# EAGLE design P8X32A_Breakout (EAGLE 6.3)
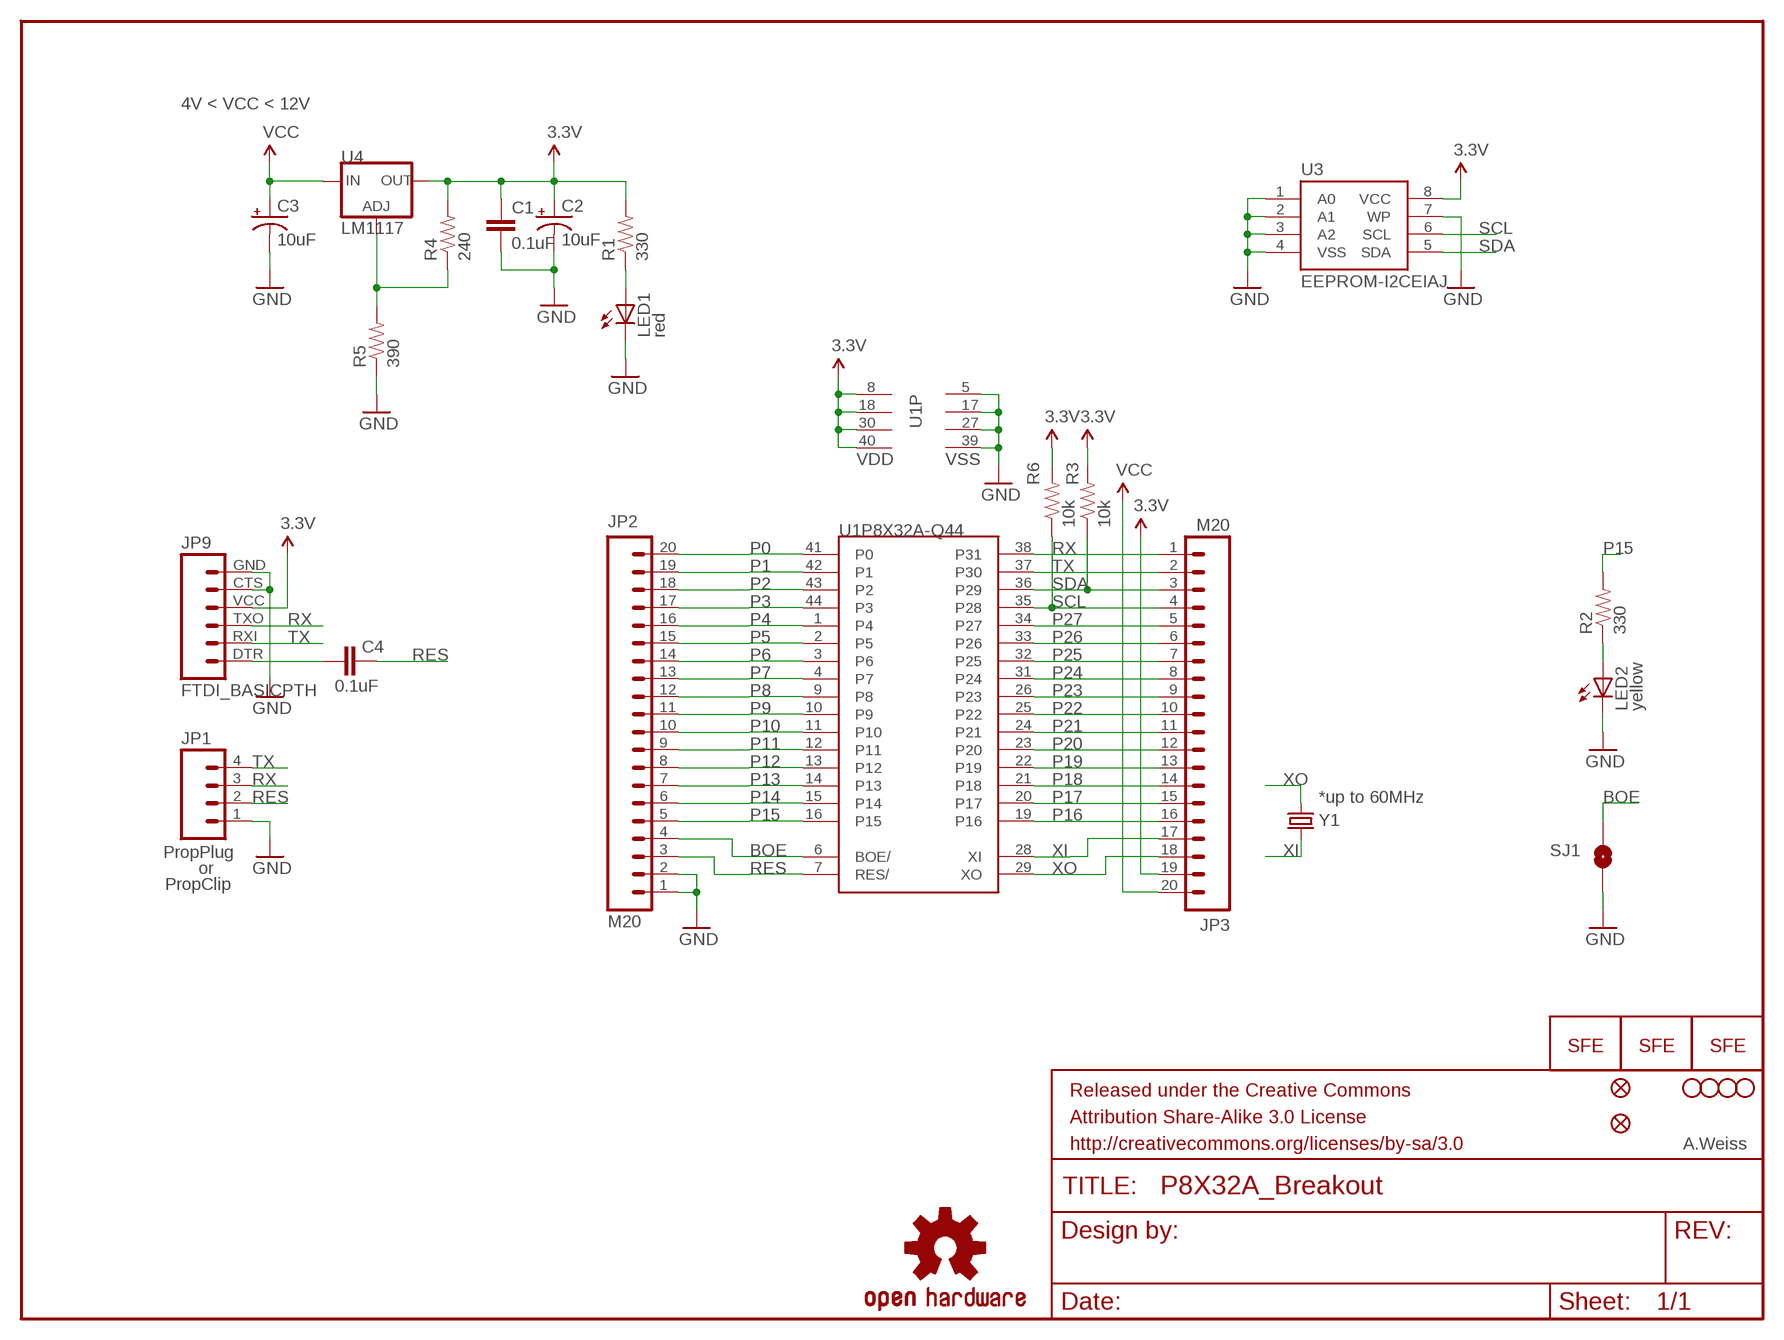
[diagram p0: schematic, sheet 1]

## Parts
C1  0.1uF  CAP0402-CAP  [0402-CAP]
C2  10uF  CAP_POL1206  [EIA3216]
C3  10uF  CAP_POL1206  [EIA3216]
C4  0.1uF  CAP0402-CAP  [0402-CAP]
FRAME1  FRAME-LETTER  [CREATIVE_COMMONS]
JP1  PropPlug  M04PTH  [1X04]
JP2  M20  [1X20]
JP3  M20  [1X20]
JP4  FIDUCIALUFIDUCIAL  [MICRO-FIDUCIAL]
JP5  LOGO-SFENEW  [SFE-NEW-WEBLOGO]
JP7  LOGO-SFESK  [SFE-LOGO-FLAME]
JP9  FTDI_BASICPTH  [FTDI_BASIC]
JP10  STAND-OFF  [STAND-OFF]
JP11  STAND-OFF  [STAND-OFF]
JP12  STAND-OFF  [STAND-OFF]
JP13  STAND-OFF  [STAND-OFF]
JP14  LOGO-SFENW2  [SFE-NEW-WEB]
JP15  FIDUCIALUFIDUCIAL  [MICRO-FIDUCIAL]
LED1  red  LED0603  [LED-0603]
LED2  yellow  LED0603  [LED-0603]
R1  330  RESISTOR0402-RES  [0402-RES]
R2  330  RESISTOR0402-RES  [0402-RES]
R3  10k  RESISTOR0402-RES  [0402-RES]
R4  240  RESISTOR0402-RES  [0402-RES]
R5  390  RESISTOR0402-RES  [0402-RES]
R6  10k  RESISTOR0402-RES  [0402-RES]
SJ1  SOLDERJUMPERTRACE  [SJ_2S-TRACE]
U1  P8X32A-Q44  [P8X32A-Q44]
U3  EEPROM-I2CEIAJ  [SO08-EIAJ]
U4  V_REG_317SMD  [SOT223]
U$1  OSHW-LOGOS  [OSHW-LOGO-S]
Y1  CRYSTALHC49UV  [HC49U-V]

## Nets
3.3V: C1.1 C2.A(+) JP3.19 JP9.VCC R1.2 R3.2 R4.2 R6.2 U1.8(P:VDD) U1.18(P:VDD) U1.30(P:VDD) U1.40(P:VDD) U3.8(VCC) U4.2(OUT)
BOE: JP2.4 SJ1.2 U1.6(P8X32A-Q44:BOE/)
GND: C1.2 C2.C(-) C3.C(-) JP1.1 JP2.1 JP2.2 JP9.CTS JP9.GND LED1.C LED2.C R5.1 SJ1.1 U1.5(P:VSS) U1.17(P:VSS) U1.27(P:VSS) U1.39(P:VSS) U3.1(A0) U3.2(A1) U3.3(A2) U3.4(VSS) U3.7(WP)
N$1: LED1.A R1.1
N$2: LED2.A R2.1
N$3: R4.1 R5.2 U4.1(ADJ)
N$5: C4.1 JP9.DTR
P0: JP2.20 U1.41(P8X32A-Q44:P0)
P1: JP2.19 U1.42(P8X32A-Q44:P1)
P2: JP2.18 U1.43(P8X32A-Q44:P2)
P3: JP2.17 U1.44(P8X32A-Q44:P3)
P4: JP2.16 U1.1(P8X32A-Q44:P4)
P5: JP2.15 U1.2(P8X32A-Q44:P5)
P6: JP2.14 U1.3(P8X32A-Q44:P6)
P7: JP2.13 U1.4(P8X32A-Q44:P7)
P8: JP2.12 U1.9(P8X32A-Q44:P8)
P9: JP2.11 U1.10(P8X32A-Q44:P9)
P10: JP2.10 U1.11(P8X32A-Q44:P10)
P11: JP2.9 U1.12(P8X32A-Q44:P11)
P12: JP2.8 U1.13(P8X32A-Q44:P12)
P13: JP2.7 U1.14(P8X32A-Q44:P13)
P14: JP2.6 U1.15(P8X32A-Q44:P14)
P15: JP2.5 R2.2 U1.16(P8X32A-Q44:P15)
P16: JP3.16 U1.19(P8X32A-Q44:P16)
P17: JP3.15 U1.20(P8X32A-Q44:P17)
P18: JP3.14 U1.21(P8X32A-Q44:P18)
P19: JP3.13 U1.22(P8X32A-Q44:P19)
P20: JP3.12 U1.23(P8X32A-Q44:P20)
P21: JP3.11 U1.24(P8X32A-Q44:P21)
P22: JP3.10 U1.25(P8X32A-Q44:P22)
P23: JP3.9 U1.26(P8X32A-Q44:P23)
P24: JP3.8 U1.31(P8X32A-Q44:P24)
P25: JP3.7 U1.32(P8X32A-Q44:P25)
P26: JP3.6 U1.33(P8X32A-Q44:P26)
P27: JP3.5 U1.34(P8X32A-Q44:P27)
RES: C4.2 JP1.2 JP2.3 U1.7(P8X32A-Q44:RES/)
RX: JP1.3 JP3.1 JP9.TXO U1.38(P8X32A-Q44:P31)
SCL: JP3.4 R6.1 U1.35(P8X32A-Q44:P28) U3.6(SCL)
SDA: JP3.3 R3.1 U1.36(P8X32A-Q44:P29) U3.5(SDA)
TX: JP1.4 JP3.2 JP9.RXI U1.37(P8X32A-Q44:P30)
VCC: C3.A(+) JP3.20 U4.3(IN)
XI: JP3.17 U1.28(P8X32A-Q44:XI) Y1.2
XO: JP3.18 U1.29(P8X32A-Q44:XO) Y1.1

## Notes on the sheet
- 4V < VCC < 12V
- LM1117
- *up to 60MHz
- or
- PropClip
- A.Weiss

## Library data of the parts
C1 C4 = SparkFun-Passives:CAP: Capacitor Standard 0603 ceramic capacitor, and 0.1" leaded capacitor.
C2 C3 = SparkFun-Passives:CAP_POL: Capacitor Polarized These are standard SMD and PTH capacitors. Normally 10uF, 47uF, and 100uF in electrolytic and tantalum varieties. Always verify the external diameter of the through hole cap, it varies with capacity, voltage, and manufacturer. The EIA devices should be standard.
FRAME1 = SparkFun-Aesthetics:FRAME-LETTER: Schematic Frame Standard 8.5x11 US Letter frame
JP1 = SparkFun-Connectors:M04: Header 4 Standard 4-pin 0.1" header. Use with straight break away headers (SKU : PRT-00116), right angle break away headers (PRT-00553), swiss pins (PRT-00743), machine pins (PRT-00117), and female headers (PRT-00115). Molex polarized connector foot print use with SKU : PRT-08231 with associated crimp pins and housings. 1MM SMD Version SKU: PRT-10208
JP2 JP3 = SparkFun-Connectors:M20: 1x20 .1" header This is just like the LOCK variant in that the holes are staggared by 5 mil, but except for the last two holes. They are not altered from the "standard" footprint layout. This is used for a special purpose on the layout of our Graphic LCD Backpack. Make sure you want to use this device before selecting it for you project!
JP4 JP15 = SparkFun:FIDUCIAL: Fiducial Alignment Points Various fiducial points for machine vision alignment.
JP5 JP7 JP14 = SparkFun-Aesthetics:LOGO-SFE: Spark Fun Electronics PCB Logo This is the standard Spark Fun Electronics PCB logo.
JP9 = SparkFun-Connectors:FTDI_BASIC: FTDI Basic header with labels
JP10-JP13 = SparkFun-Electromechanical:STAND-OFF: #4 Stand Off This is the mechanical footprint for a #4 phillips button head screw. Use the keepout ring to avoid running the screw head into surrounding components. SKU : PRT-00447
LED1 LED2 = SparkFun-LED:LED: LEDs Standard schematic elements and footprints for 5mm, 3mm, 1206, and 0603 sized LEDs. 5mm - Spark Fun Electronics SKU : COM-00529 (and others)
R1-R6 = SparkFun-Passives:RESISTOR: Resistor Basic schematic elements and footprints for 0603, 1206, and PTH resistors.
SJ1 = SparkFun-Passives:SOLDERJUMPER: Solder Jumper Standard SMD solder jumper. Used to automate production. Two varients : Normally Open and Normally Closed are the same, but have different paste layers. NC will have a large amount of paste and should jumper during reflow.
U1 = SparkFun-DigitalIC:P8X32A-Q44: Propellor uC
U3 = SparkFun-DigitalIC:EEPROM-I2C: I2C EEPROM chips, 24LC256 (and others)
U4 = SparkFun-PowerIC:V_REG_317: Voltage Regulator Standard LM317 adjustable voltage regulator. AOI (Adjust Output Input). Google 'LM317 Calculator' for easy to use app to get the two resistor values needed. 240/720 for 5V output. 240/390 for 3.3V output. Spark Fun Electronics SKU : COM-00527
U$1 = SparkFun-Aesthetics:OSHW-LOGO: Open Source Hardware Logo This logo indicates the piece of hardware it is found on incorporates a OSHW license and/or adheres to the definition of open source hardware found here: http://freedomdefined.org/OSHW
Y1 = SparkFun-FreqCtrl:CRYSTAL: Various standard crystals. Proven footprints. Spark Fun Electronics SKU : COM-00534

## Board
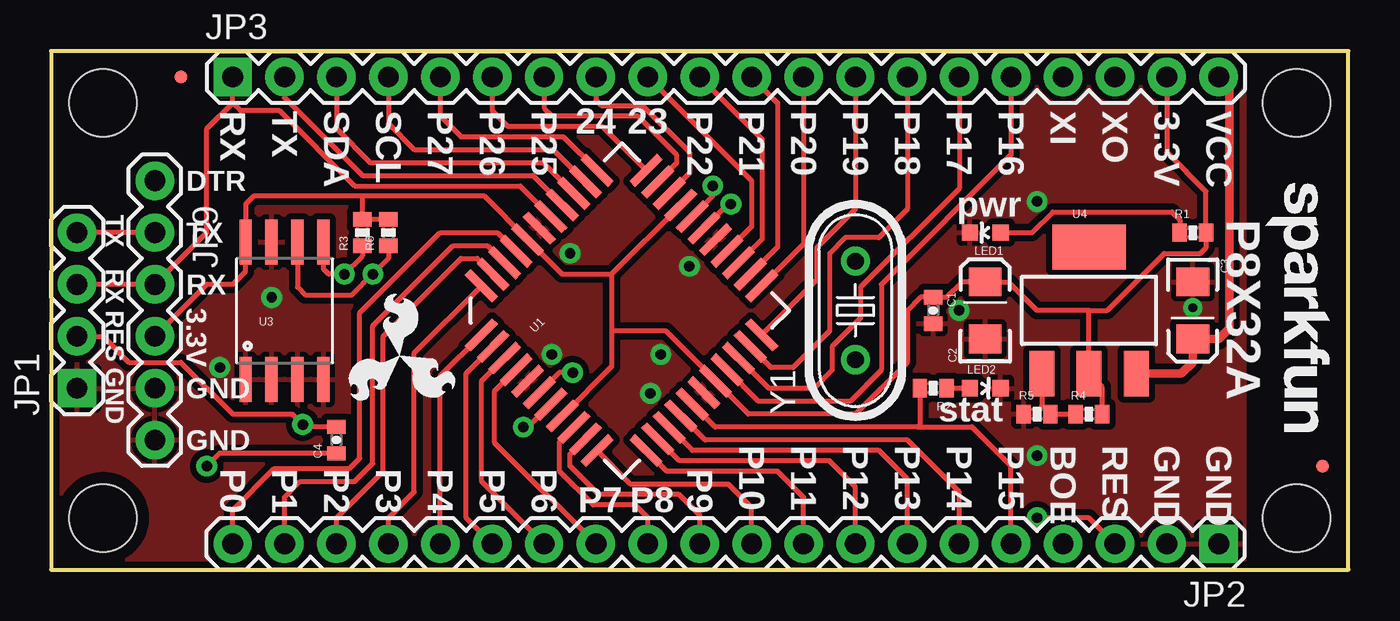
[diagram p1: board, top side]
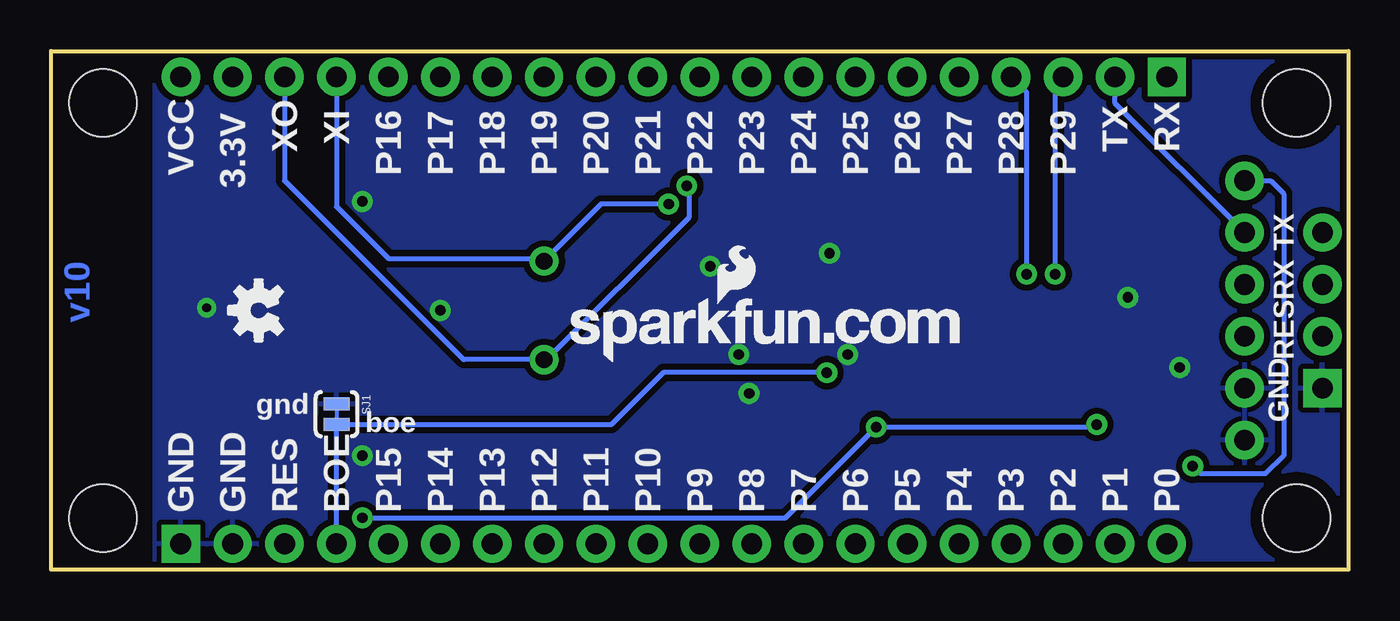
[diagram p2: board, bottom side, seen from below]

Size 63.5 x 25.4 mm. Coordinates in mm from the lower left corner, seen from the top.
Outline: 0,0 63.5,0 63.5,25.4 0,25.4 0,0
Copper layers (1*16): Top 0.035559375mm / dielectric 1.501140625mm / Bottom 0.035559375mm
Design rules "default": minimum track width 8mil, minimum drill 20mil, track to track 8mil, track to pad 8mil, pad to pad 8mil, via to via 8mil, smd to smd 8mil, copper to edge 8mil, drill to drill 8mil, minimum pad ring 12mil, minimum via ring 10mil, stop-mask expansion 4mil, vias tented up to drill 20mil, thermal gap 10mil

### Footprints (pad centres in the part's own frame; a part is rotated, then mirrored left to right if it is on the bottom)
0402-CAP = smd 0.7 x 0.9: 1 -0.65,0; 2 0.65,0
EIA3216 = smd 1.4 x 1.6: A 1.4,0; C -1.4,0
1X04 = drill 1.016 pad 1.88 square: 1 0,0 | drill 1.016 pad 1.88: 2 2.54,0; 3 5.08,0; 4 7.62,0
1X20 = drill 1.016 pad 1.88 square: 1 0,0 | drill 1.016 pad 1.88: 2 2.54,0; 3 5.08,0; 4 7.62,0; 5 10.16,0; 6 12.7,0; 7 15.24,0; 8 17.78,0; 9 20.32,0; 10 22.86,0; 11 25.4,0; 12 27.94,0; 13 30.48,0; 14 33.02,0; 15 35.56,0; 16 38.1,0; 17 40.64,0; 18 43.18,0; 19 45.72,0; 20 48.26,0
MICRO-FIDUCIAL = smd 0.635 x 0.635: 1 0,0
FTDI_BASIC = drill 1.016 pad 1.88: CTS 10.16,0; DTR 0,0; GND 12.7,0; RXI 2.54,0; TXO 5.08,0; VCC 7.62,0
STAND-OFF = hole 3.302: 0,0
LED-0603 = smd 0.8 x 0.8: A 0,-0.75; C 0,0.75
0402-RES = smd 0.7 x 0.9: 1 -0.65,0; 2 0.65,0
SJ_2S-TRACE = smd 0.635 x 1.27: 1 -0.508,0; 2 0.508,0
P8X32A-Q44 = smd 1.9 x 0.4: 1 -5.713,4.013; 2 -5.713,3.212; 3 -5.713,2.413; 4 -5.713,1.613; 5 -5.713,0.812; 6 -5.713,0.013; 7 -5.713,-0.787; 8 -5.713,-1.587; 9 -5.713,-2.388; 10 -5.713,-3.188; 11 -5.713,-3.987; 23 5.688,-3.987; 24 5.688,-3.188; 25 5.688,-2.388; 26 5.688,-1.587; 27 5.688,-0.787; 28 5.688,0.013; 29 5.688,0.812; 30 5.688,1.613; 31 5.688,2.413; 32 5.688,3.212; 33 5.688,4.013 | smd 0.4 x 1.9: 12 -4.013,-5.688; 13 -3.212,-5.688; 14 -2.413,-5.688; 15 -1.613,-5.688; 16 -0.812,-5.688; 17 -0.013,-5.688; 18 0.787,-5.688; 19 1.587,-5.688; 20 2.388,-5.688; 21 3.188,-5.688; 22 3.987,-5.688; 34 3.987,5.713; 35 3.188,5.713; 36 2.388,5.713; 37 1.587,5.713; 38 0.787,5.713; 39 -0.013,5.713; 40 -0.812,5.713; 41 -1.613,5.713; 42 -2.413,5.713; 43 -3.212,5.713; 44 -4.013,5.713
SO08-EIAJ = smd 0.61 x 2.21: 1 -1.905,-3.378; 2 -0.635,-3.378; 3 0.635,-3.378; 4 1.905,-3.378; 5 1.905,3.353; 6 0.635,3.353; 7 -0.635,3.353; 8 -1.905,3.353
SOT223 = smd 1.219 x 2.235: 1 -2.311,-3.099; 2 0,-3.099; 3 2.311,-3.099 | smd 3.6 x 2.2: 4 0,3.099
HC49U-V = drill 0.813: 1 -2.413,0; 2 2.413,0

### Placement (x,y rotation side)
C1  43.18,12.7 270 top
C2  45.72,12.7 90 top
C3  55.88,12.7 270 top
C4  13.97,6.35 90 top
FRAME1  3.56,-2.54 0 top
JP1  1.27,8.89 90 top
JP2  57.15,1.27 180 top
JP3  8.89,24.13 0 top
JP4  6.35,24.13 0 top
JP5  38.1,10.16 0 bottom
JP6  LOGO-SFESK  [SFE-LOGO-FLAME]  17.07,10.47 155 top
JP7  17.07,10.47 30 top
JP8  LOGO-SFESK  [SFE-LOGO-FLAME]  17.07,10.47 265 top
JP9  5.08,19.05 270 top
JP10  60.96,22.86 0 top
JP11  60.96,2.54 0 top
JP12  2.54,2.54 0 top
JP13  2.54,22.86 0 top
JP14  59.44,18.92 270 top
JP15  62.23,5.08 0 top
LED1  45.72,16.51 90 top
LED2  45.72,8.89 270 top
R1  55.88,16.51 0 top
R2  43.18,8.89 180 top
R3  15.24,16.51 90 top
R4  50.8,7.62 0 top
R5  48.26,7.62 0 top
R6  16.51,16.51 90 top
SJ1  49.53,7.62 270 bottom
U1  27.94,12.7 45 top
U3  11.43,12.7 0 top
U4  50.8,12.7 0 top
U$1  53.34,12.7 90 bottom
Y1  39.37,12.7 90 top

### Tracks (layer width: path | path; a pad name or v marks a point on that pad's centre or on a via)
3.3V
  Top 0.254: 27.44,14.48 25.02,14.48 U1.40 21.21,18.29 15.24,18.29 | 27.44,14.48 U1.30 | 27.44,14.48 27.44,11.68 | 27.44,11.68 27.44,9.95 U1.8 | 27.44,11.68 30.1,11.68 32.52,9.26 U1.18 34.13,7.62 39.37,7.62 41.91,10.16 41.91,12.7 42.56,13.35 C1.1 43.83,13.35 44.58,14.1 C2.A 46.86,14.1 48.26,12.7 50.8,12.7 | R4.2 51.45,8.95 U4.2 50.8,12.7 | 50.8,12.7 51.69,12.7 54.48,15.49 56.26,15.49 56.53,15.76 R1.2 56.53,18.53 54.61,20.45 JP3.19 | JP9.VCC 7.62,13.97 8.89,13.97 9.51,14.59 9.51,16.07 U3.8 9.53,17.91 9.91,18.29 15.24,18.29 | R6.2 R3.2 15.24,18.29
BOE  (via drill 0.51)
  Top 0.254: v25.53,9.65 24.87,9.65 U1.6
  Bottom 0.254: JP2.4 SJ1.2 36.07,7.11 33.53,9.65 v25.53,9.65
GND  (via drill 0.43, 0.51)
  other vias: 48.26,18.03 44.45,12.7 24.51,10.54 25.4,15.49 31.24,14.86 29.84,10.54 29.34,8.64 8.26,9.91 10.79,13.34 48.26,5.59 55.88,12.83
  pour Bottom (isolate 0.305): 0,25.4 0,0 58.42,0 58.42,25.4
  pour Top (isolate 0.305): 0,25.4 0,0 58.42,0 58.42,25.4
N$1
  Top 0.254: LED1.A 48.01,16.51 49.02,17.53 54.86,17.53 55.24,17.14 55.24,16.52 R1.1
N$2
  Top 0.254: LED2.A R2.1
N$3
  Top 0.254: U4.1 48.49,8.04 R5.2 R4.1
N$5  (via drill 0.51)
  Top 0.254: C4.1 8.24,5.7 v7.62,5.08
  Bottom 0.254: JP9.DTR 3.81,19.05 3.17,18.41 3.17,5.59 4.06,4.7 7.24,4.7 v7.62,5.08
P0
  Top 0.254: JP2.20 8.89,2.92 10.92,4.95 14.61,4.95 15.11,5.46 15.11,12.57 19.05,16.51 21.85,16.51 U1.41
P1
  Top 0.254: JP2.19 11.43,3.56 12.19,4.32 14.86,4.32 15.75,5.21 15.75,11.94 19.68,15.88 21.35,15.88 U1.42
P2
  Top 0.254: JP2.18 13.97,2.54 16.26,4.83 16.26,11.43 20.07,15.24 20.86,15.24 U1.43
P3
  Top 0.254: JP2.17 16.51,2.54 17.78,3.81 17.78,10.62 U1.44
P4
  Top 0.254: JP2.16 19.05,9.48 U1.1
P5
  Top 0.254: JP2.15 20.32,2.54 20.32,9.62 U1.2
P6
  Top 0.254: JP2.14 21.08,4.32 21.08,9.25 U1.3
P7
  Top 0.254: JP2.13 21.72,6.22 21.72,8.76 U1.4
P8
  Top 0.254: JP2.12 29.21,2.54 28.57,3.17 26.54,3.17 24.89,4.83 24.89,6.28 U1.9
P9
  Top 0.254: JP2.11 31.75,2.67 30.73,3.68 26.8,3.68 25.4,5.08 25.4,5.65 U1.10
P10
  Top 0.254: JP2.10 34.29,3.05 33.15,4.19 28.37,4.19 U1.11
P11
  Top 0.254: JP2.9 36.83,3.56 35.56,4.83 30.14,4.83 U1.12
P12
  Top 0.254: JP2.8 39.37,4.06 38.1,5.33 30.76,5.33 U1.13
P13
  Top 0.254: JP2.7 41.91,4.45 40.51,5.84 31.39,5.84 U1.14
P14
  Top 0.254: JP2.6 44.45,3.81 41.91,6.35 32.01,6.35 U1.15
P15
  Top 0.254: JP2.5 46.99,5.08 45.07,7 45.05,6.99 42.42,6.99 | 42.42,6.99 32.51,6.99 U1.16 | R2.2 42.53,7.1 42.42,6.99
P16
  Top 0.254: JP3.16 46.99,20.32 40.64,13.97 40.64,9.78 39.12,8.26 34.63,8.26 U1.19
P17
  Top 0.254: JP3.15 44.45,18.67 39.62,13.84 39.62,12.32 38.23,10.92 38.23,9.78 37.34,8.89 35.13,8.89 U1.20
P18
  Top 0.254: JP3.14 41.91,17.65 40.51,16.26 38.86,16.26 38.1,15.49 38.1,11.68 36.32,9.91 35.24,9.91 U1.21
P19
  Top 0.254: JP3.13 39.37,17.65 37.47,15.75 37.47,14.18 U1.22
P20
  Top 0.254: JP3.12 36.83,15.95 U1.23
P21
  Top 0.254: JP3.11 35.56,22.86 35.56,15.81 U1.24
P22
  Top 0.254: JP3.10 34.8,21.08 34.8,16.18 U1.25
P23
  Top 0.254: JP3.9 34.29,19.05 34.29,16.8 U1.26
P24
  Top 0.254: JP3.8 26.67,22.99 26.92,22.73 28.96,22.73 31.24,20.45 31.24,19.41 U1.31
P25
  Top 0.254: JP3.7 24.13,22.61 24.51,22.23 28.7,22.23 30.61,20.32 30.61,19.91 U1.32
P26
  Top 0.254: JP3.6 21.59,22.48 22.35,21.72 26.97,21.72 U1.33
P27
  Top 0.254: JP3.5 19.05,22.23 20.07,21.21 25.07,21.21 U1.34
RES  (via drill 0.51)
  Top 0.254: v23.11,6.99 23.34,6.99 U1.7 | JP2.3 50.8,2.54 v48.26,2.54 | JP1.2 2.54,11.43 3.81,10.16 6.35,10.16 8.89,7.62 11.81,7.62 v12.32,7.11 12.43,7 C4.2
  Bottom 0.254: v48.26,2.54 27.56,2.54 v23.11,6.99 12.45,6.99 v12.32,7.11
RX
  Top 0.254: 8.89,22.86 JP3.1 | U1.38 22.96,18.8 14.86,18.8 11.18,22.48 9.27,22.48 8.89,22.86 | JP1.3 JP9.TXO 7.62,16.51 7.62,21.59 8.89,22.86
SCL  (via drill 0.51)
  Top 0.254: JP3.4 16.51,21.84 17.78,20.57 24.57,20.57 U1.35 | U3.6 12.06,13.84 12.45,13.46 14.73,13.46 v15.75,14.48 16.51,15.24 R6.1
  Bottom 0.254: v15.75,14.48 15.75,23.37 JP3.4
SDA  (via drill 0.51)
  Top 0.254: JP3.3 13.97,21.59 15.62,19.94 24.08,19.94 U1.36 | R3.1 15.24,15.37 v14.35,14.48 13.59,14.48 13.34,14.73 U3.5
  Bottom 0.254: v14.35,14.48 14.35,23.75 JP3.3
TX
  Top 0.254: JP3.2 11.43,23.11 15.24,19.3 23.58,19.3 U1.37 | JP9.RXI JP1.4
  Bottom 0.254: JP9.RXI 11.43,22.86 JP3.2
VCC
  Top 0.406: U4.3 55.32,9.6 55.88,10.16 C3.A 57.15,11.3 57.66,11.81 57.66,23.62 JP3.20
XI  (via drill 0.51)
  Top 0.254: v33.27,17.91 33.13,17.91 U1.28
  Bottom 0.254: JP3.17 49.53,17.78 46.99,15.24 39.5,15.24 Y1.2 36.58,17.91 v33.27,17.91
XO  (via drill 0.51)
  Top 0.254: v32.38,18.8 32.38,18.29 U1.29
  Bottom 0.254: JP3.18 52.07,19.05 43.31,10.29 Y1.1 39.24,10.29 32.26,17.27 32.26,18.67 v32.38,18.8

### Text on the board
Bottom: v10
tPlace: RX | TX | SDA | SCL | P27 | P26 | P25 | P22 | P21 | P20 | P19 | P18 | P17 | P16 | XI | XO | 3.3V | VCC | 24 | 23 | DTR | TX | pwr | P8X32A | TX | RX | RES | 3.3V | RX | GND | GND | stat | GND | P10 | P11 | P12 | P13 | P14 | P15 | BOE | RES | GND | GND | P0 | P1 | P2 | P3 | P4 | P5 | P6 | P9 | P7 | P8
bPlace: XI | RX | TX | XO | P29 | P28 | P27 | P26 | P25 | P24 | P23 | P22 | P21 | P20 | P19 | P18 | P17 | P16 | 3.3V | VCC | TX | RX | RES | gnd | GND | boe | P0 | P1 | P2 | P3 | P4 | P5 | P6 | P7 | P8 | P9 | P10 | P11 | P12 | P13 | P14 | P15 | BOE | RES | GND | GND